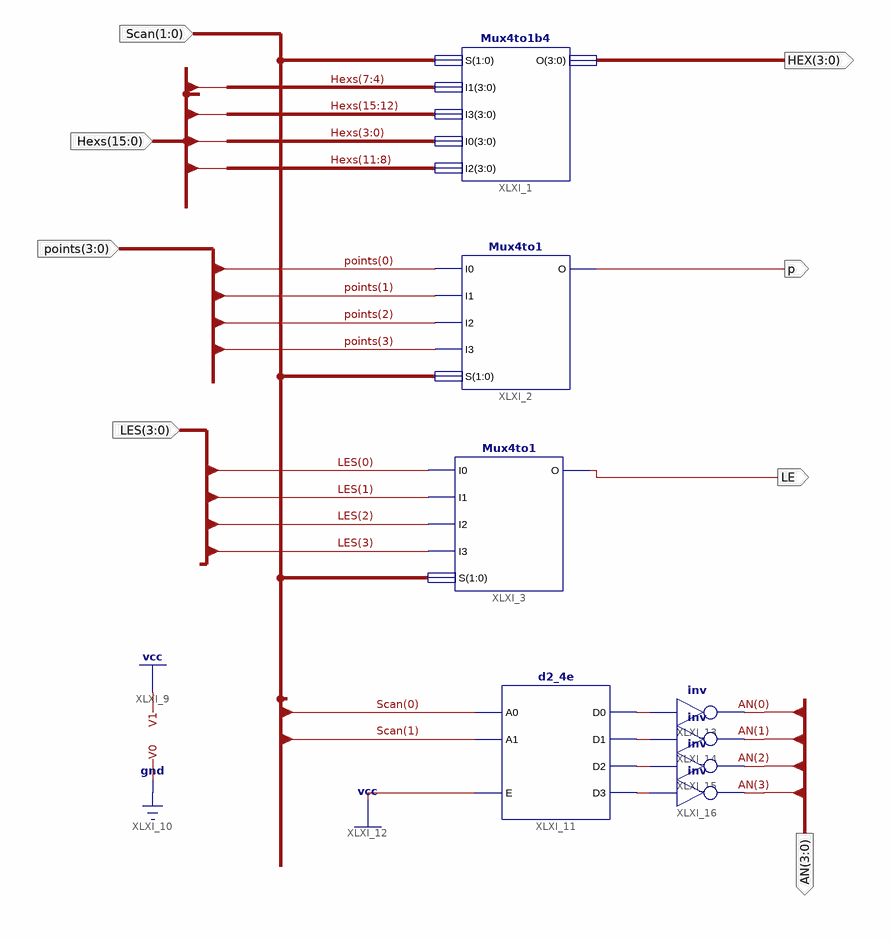
[diagram p0: schematic sheet 1]
// Xilinx ISE schematic DisplaySync.sch (kintex7) as structural Verilog: 8 symbols, 8 ports
module DisplaySync (
  input  [1:0] Scan,
  input  [15:0] Hexs,
  input  [3:0] points,
  input  [3:0] LES,
  output [3:0] HEX,
  output p,
  output LE,
  output [3:0] AN
);

  wire XLXN_6, XLXN_7, XLXN_8, XLXN_9;

  Mux4to1b4 XLXI_1 (.S(Scan), .I1(Hexs[7:4]), .I3(Hexs[15:12]), .I0(Hexs[3:0]), .I2(Hexs[11:8]), .O(HEX));
  Mux4to1 XLXI_2 (.S(Scan), .I0(points[0]), .I1(points[1]), .I2(points[2]), .I3(points[3]), .O(p));
  Mux4to1 XLXI_3 (.S(Scan), .I0(LES[0]), .I1(LES[1]), .I2(LES[2]), .I3(LES[3]), .O(LE));
  d2_4e XLXI_11 (.A0(Scan[0]), .A1(Scan[1]), .E(1'b1), .D0(XLXN_6), .D1(XLXN_7), .D2(XLXN_8), .D3(XLXN_9));
  not XLXI_13 (AN[0], XLXN_6);
  not XLXI_14 (AN[1], XLXN_7);
  not XLXI_15 (AN[2], XLXN_8);
  not XLXI_16 (AN[3], XLXN_9);
endmodule
